# Altium schematic sheet [01] - COVER PAGE.SchDoc
size Letter; Organization: Altium Limited; Address1: L3, 12a Rodborough Rd; Address2: Frenchs Forest; Address3: NSW; Address4: Australia 2086; SheetNumber: 1; SheetTotal: 5
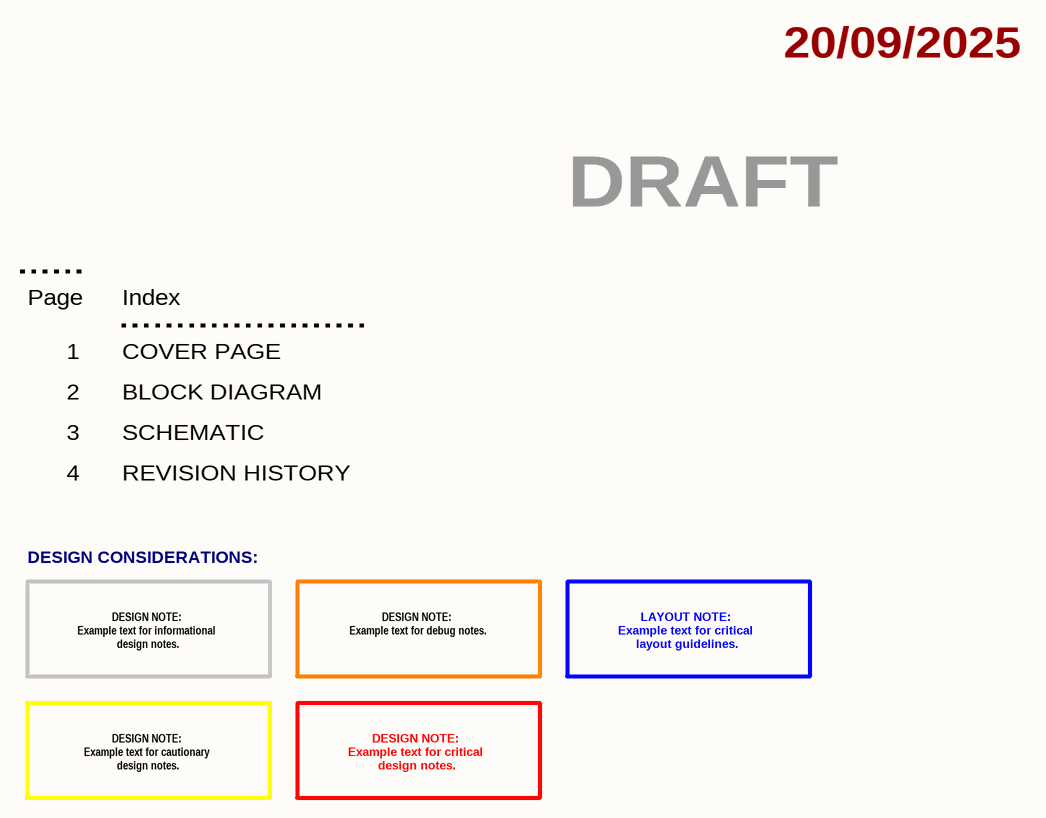
[diagram p0: [01] - COVER PAGE.SchDoc]

## Notes on the sheet
- 20/09/2025
- DRAFT
- Page
- Index
- 1
- 2
- COVER PAGE
- BLOCK DIAGRAM
- 3
- 4
- SCHEMATIC
- REVISION HISTORY
- DESIGN CONSIDERATIONS:
- DESIGN NOTE:
  Example text for informational
  design notes.
- DESIGN NOTE:
  Example text for debug notes.
- LAYOUT NOTE:
  Example text for critical
  layout guidelines.
- DESIGN NOTE:
  Example text for cautionary
  design notes.
- DESIGN NOTE:
  Example text for critical
  design notes.
- Proyecto:
- Autor:
- Carnet:
- Documento:
- Curso:
- Revisión:
- Fecha:
- Tamaño:
- Carta
- Hoja:
- De